# EAGLE schematic mainboard (EAGLE 9.6.2)
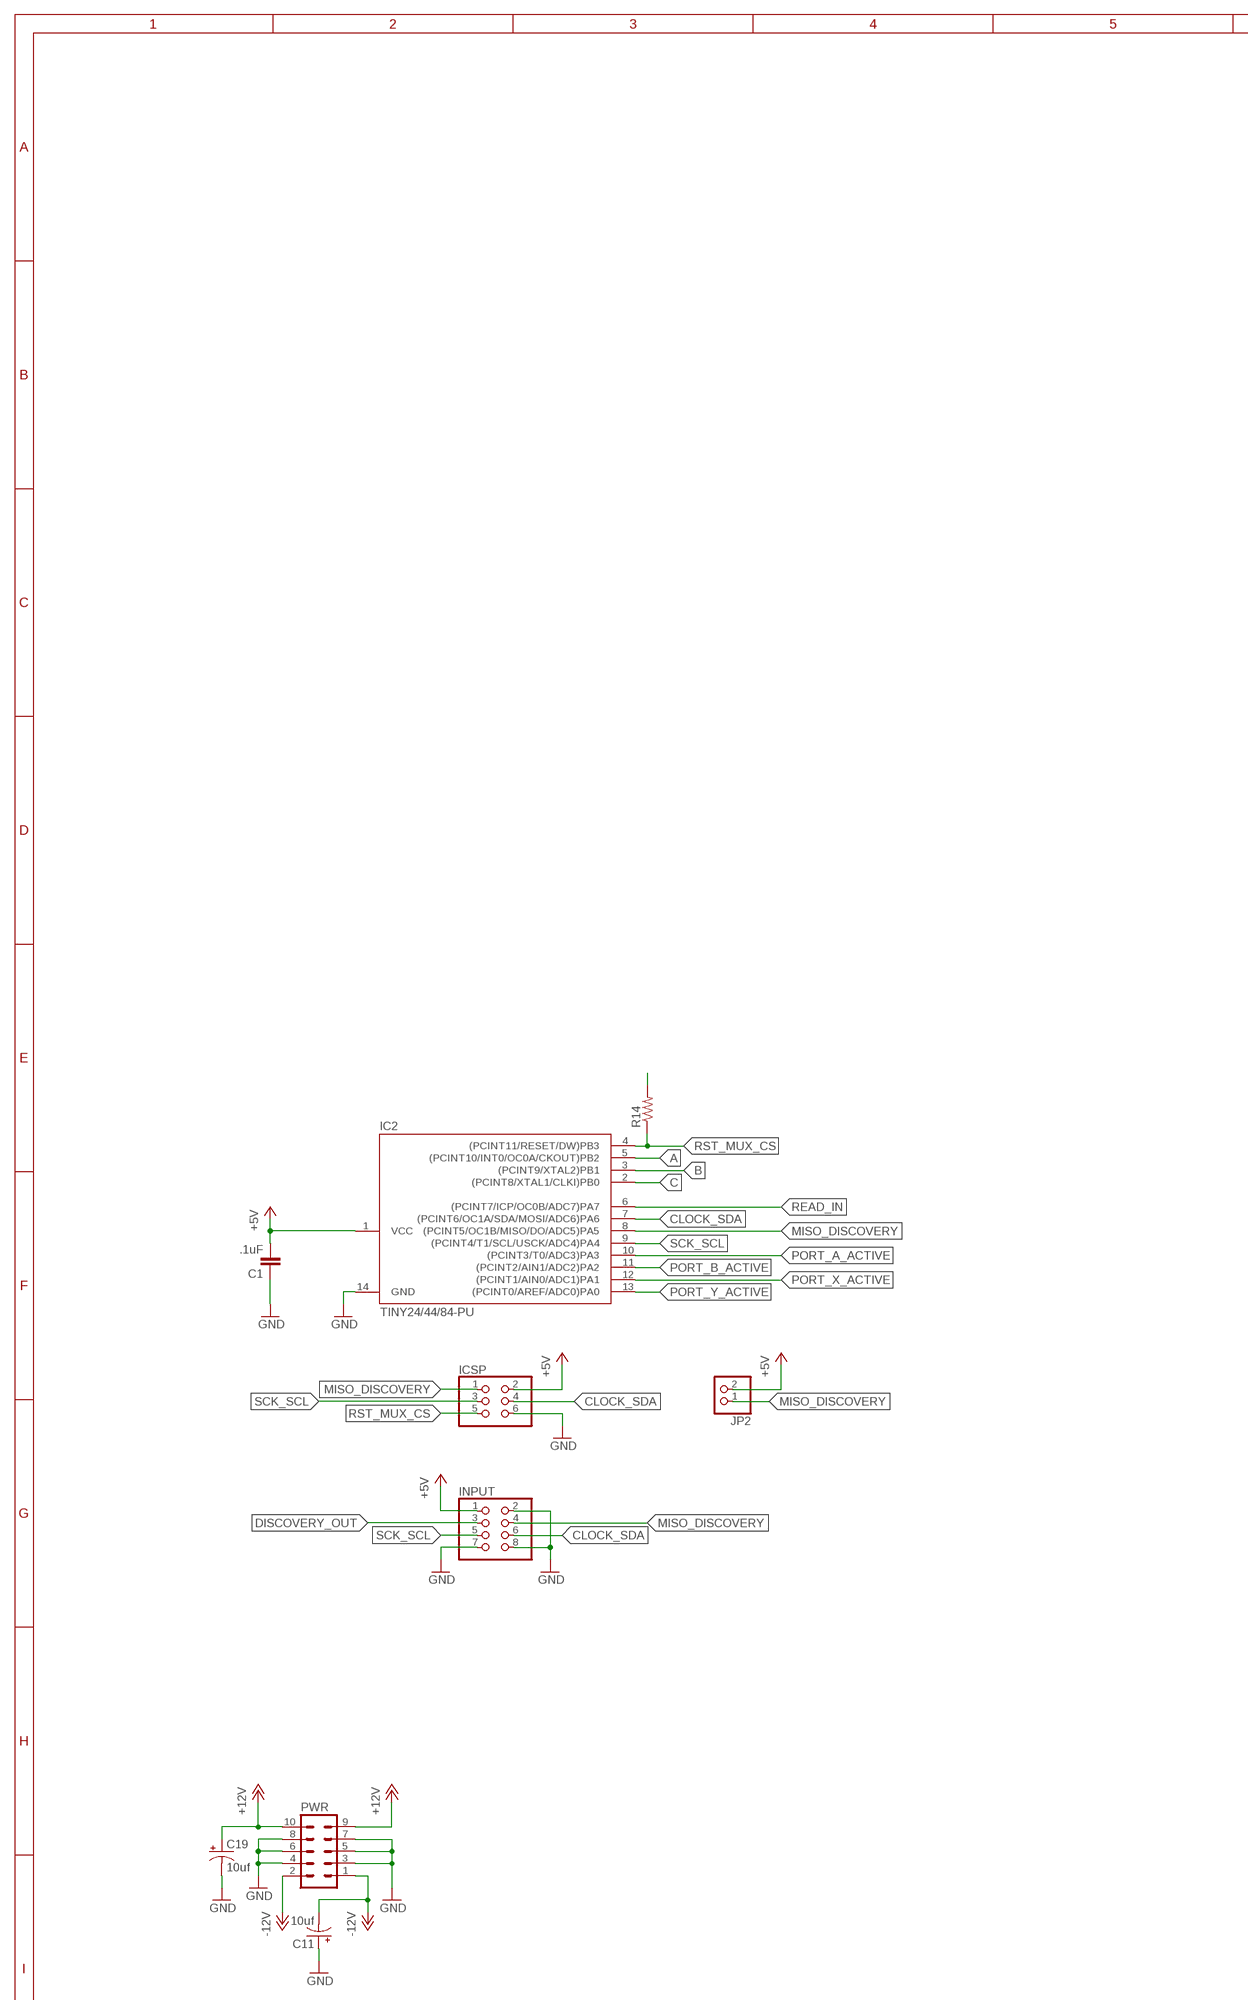
[diagram p0: schematic, sheet 1, part 1 of 2]
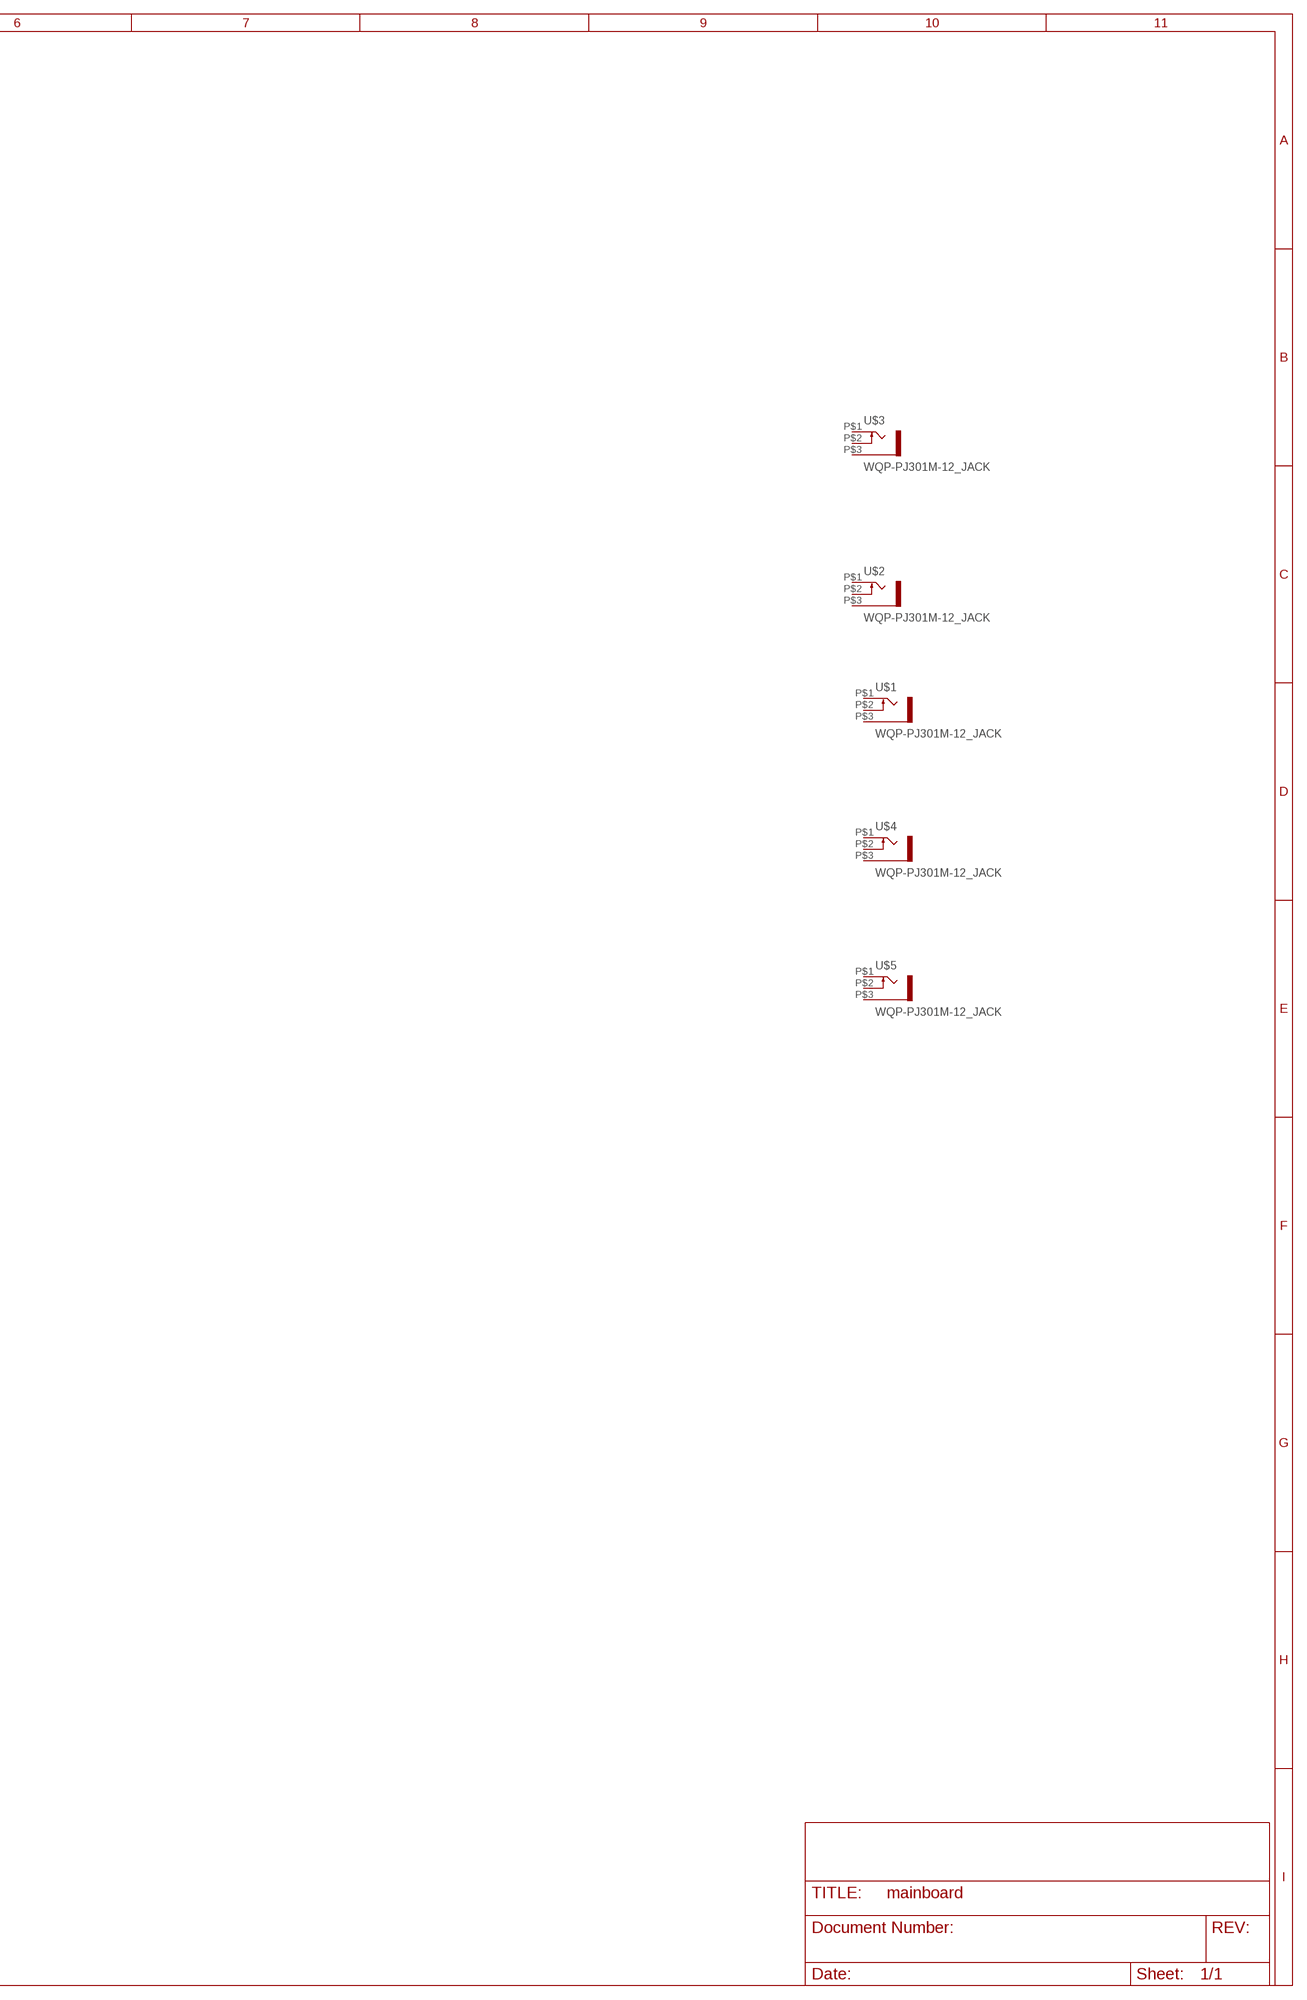
[diagram p1: schematic, sheet 1, part 2 of 2]

## Parts
C1  .1uF  C-EU050-024X044  [C050-024X044]
C11  10uf  CPOL-USE2.5-5  [E2,5-5]
C19  10uf  CPOL-USE2.5-5  [E2,5-5]
IC2  TINY24/44/84-PU  [DIL14]
ICSP  PINHD-2X3  [2X03]
INPUT  PINHD-2X4  [2X04]
JP2  PINHD-1X2  [1X02]
PWR  ML10  [ML10]
R14  R-US_0204/7  [0204/7]
U$1  WQP-PJ301M-12_JACK  [WQP-PJ301M-12_JACK]
U$2  WQP-PJ301M-12_JACK  [WQP-PJ301M-12_JACK]
U$3  WQP-PJ301M-12_JACK  [WQP-PJ301M-12_JACK]
U$4  WQP-PJ301M-12_JACK  [WQP-PJ301M-12_JACK]
U$5  WQP-PJ301M-12_JACK  [WQP-PJ301M-12_JACK]

## Nets
+5V: C1.2 IC2.1(VCC) ICSP.2 INPUT.1 JP2.2 R14.2
+12V: C19.+ PWR.9 PWR.10
-12V: C11.- PWR.1 PWR.2
A: IC2.5((PCINT10/INT0/OC0A/CKOUT)PB2)
B: IC2.3((PCINT9/XTAL2)PB1)
C: IC2.2((PCINT8/XTAL1/CLKI)PB0)
CLOCK_SDA: IC2.7((PCINT6/OC1A/SDA/MOSI/ADC6)PA6) ICSP.4 INPUT.6
DISCOVERY_OUT: INPUT.3
GND: C1.1 C11.+ C19.- IC2.14(GND) ICSP.6 INPUT.2 INPUT.7 INPUT.8 PWR.3 PWR.4 PWR.5 PWR.6 PWR.7 PWR.8
MISO_DISCOVERY: IC2.8((PCINT5/OC1B/MISO/DO/ADC5)PA5) ICSP.1 INPUT.4 JP2.1
PORT_A_ACTIVE: IC2.10((PCINT3/T0/ADC3)PA3)
PORT_B_ACTIVE: IC2.11((PCINT2/AIN1/ADC2)PA2)
PORT_X_ACTIVE: IC2.12((PCINT1/AIN0/ADC1)PA1)
PORT_Y_ACTIVE: IC2.13((PCINT0/AREF/ADC0)PA0)
READ_IN: IC2.6((PCINT7/ICP/OC0B/ADC7)PA7)
RST_MUX_CS: IC2.4((PCINT11/RESET/DW)PB3) ICSP.5 R14.1
SCK_SCL: IC2.9((PCINT4/T1/SCL/USCK/ADC4)PA4) ICSP.3 INPUT.5
Unconnected: U$1.P$1 U$1.P$2 U$1.P$3 U$2.P$1 U$2.P$2 U$2.P$3 U$3.P$1 U$3.P$2 U$3.P$3 U$4.P$1 U$4.P$2 U$4.P$3 U$5.P$1 U$5.P$2 U$5.P$3

## Library data of the parts
C1 = rcl:C-EU: CAPACITOR, European symbol; SPICEPREFIX: C
C11 C19 = resistor:CPOL-US: POLARIZED CAPACITOR, American symbol
IC2 = avr-7:TINY24/44/84
ICSP = pinhead:PINHD-2X3: PIN HEADER
INPUT = pinhead:PINHD-2X4: PIN HEADER
JP2 = pinhead:PINHD-1X2: PIN HEADER
PWR = con-ml:ML10: HARTING; OC_FARNELL: unknown; OC_NEWARK: unknown
R14 = rcl:R-US_: RESISTOR, American symbol; SPICEPREFIX: R
U$1-U$5 = thonkiconn:WQP-PJ301M-12_JACK